# Altium schematic sheet 0115.SchDoc
size 848 x 558 mm
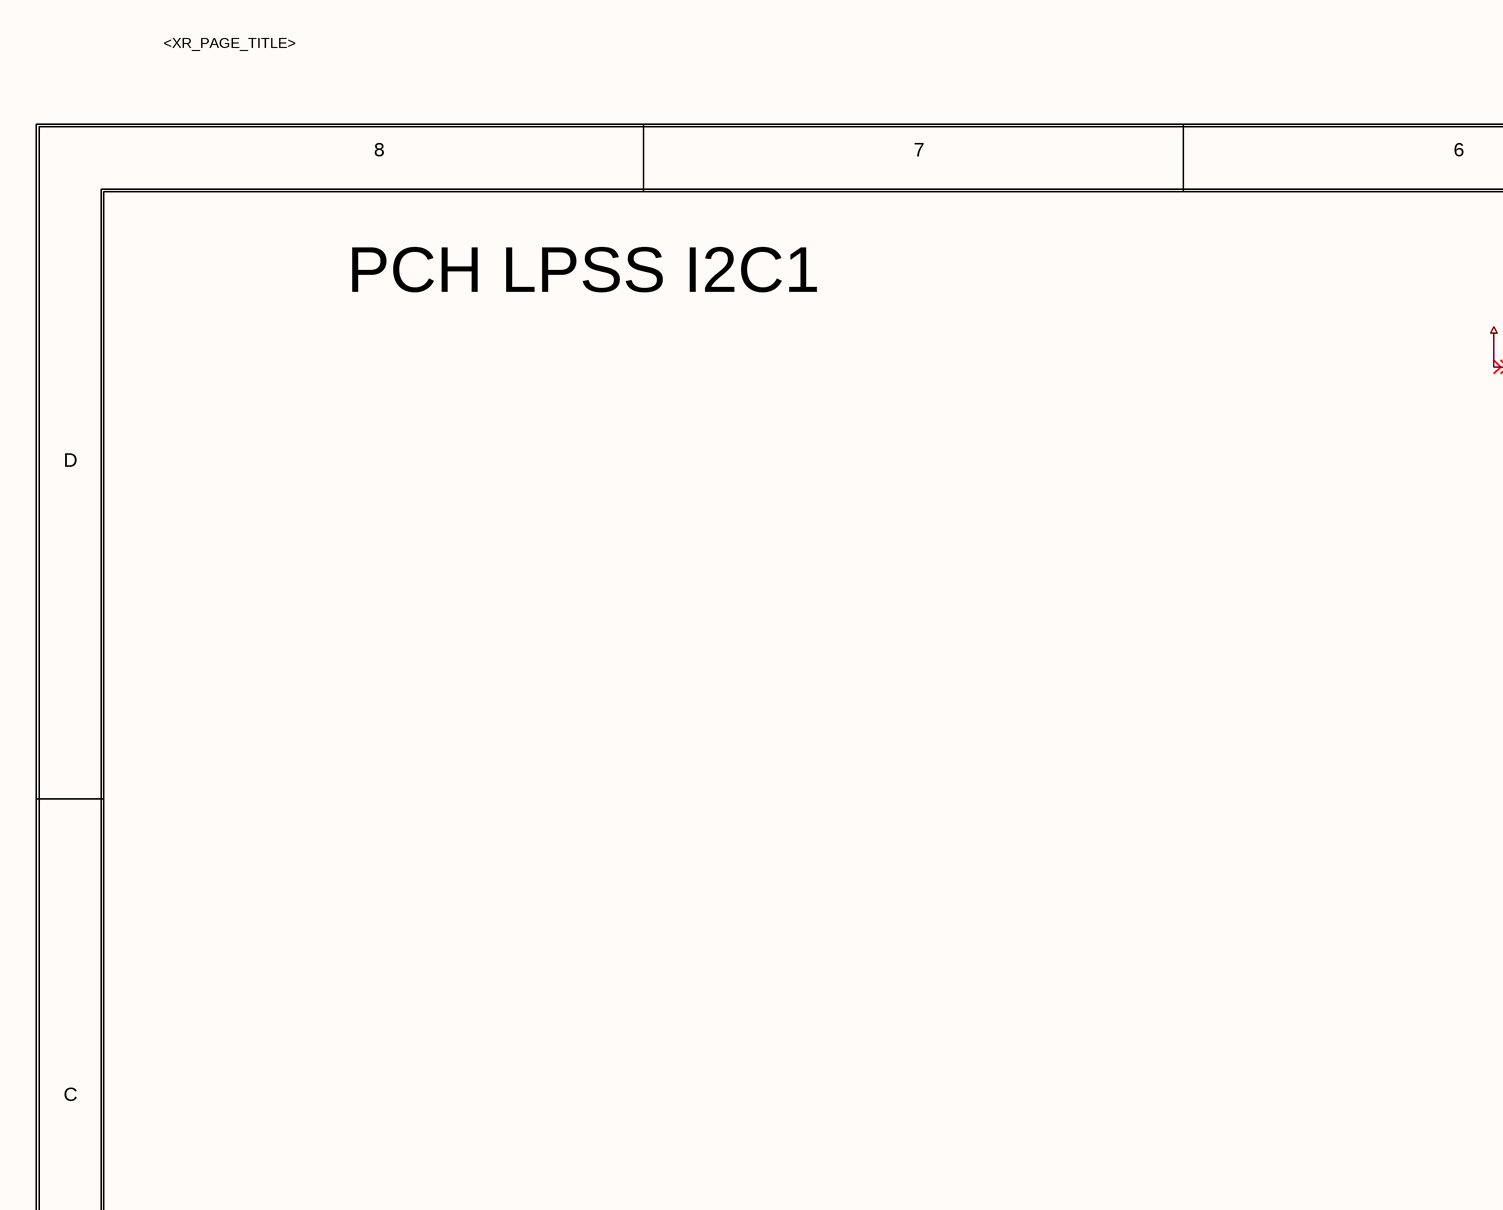
[diagram p0: 0115.SchDoc, top left]
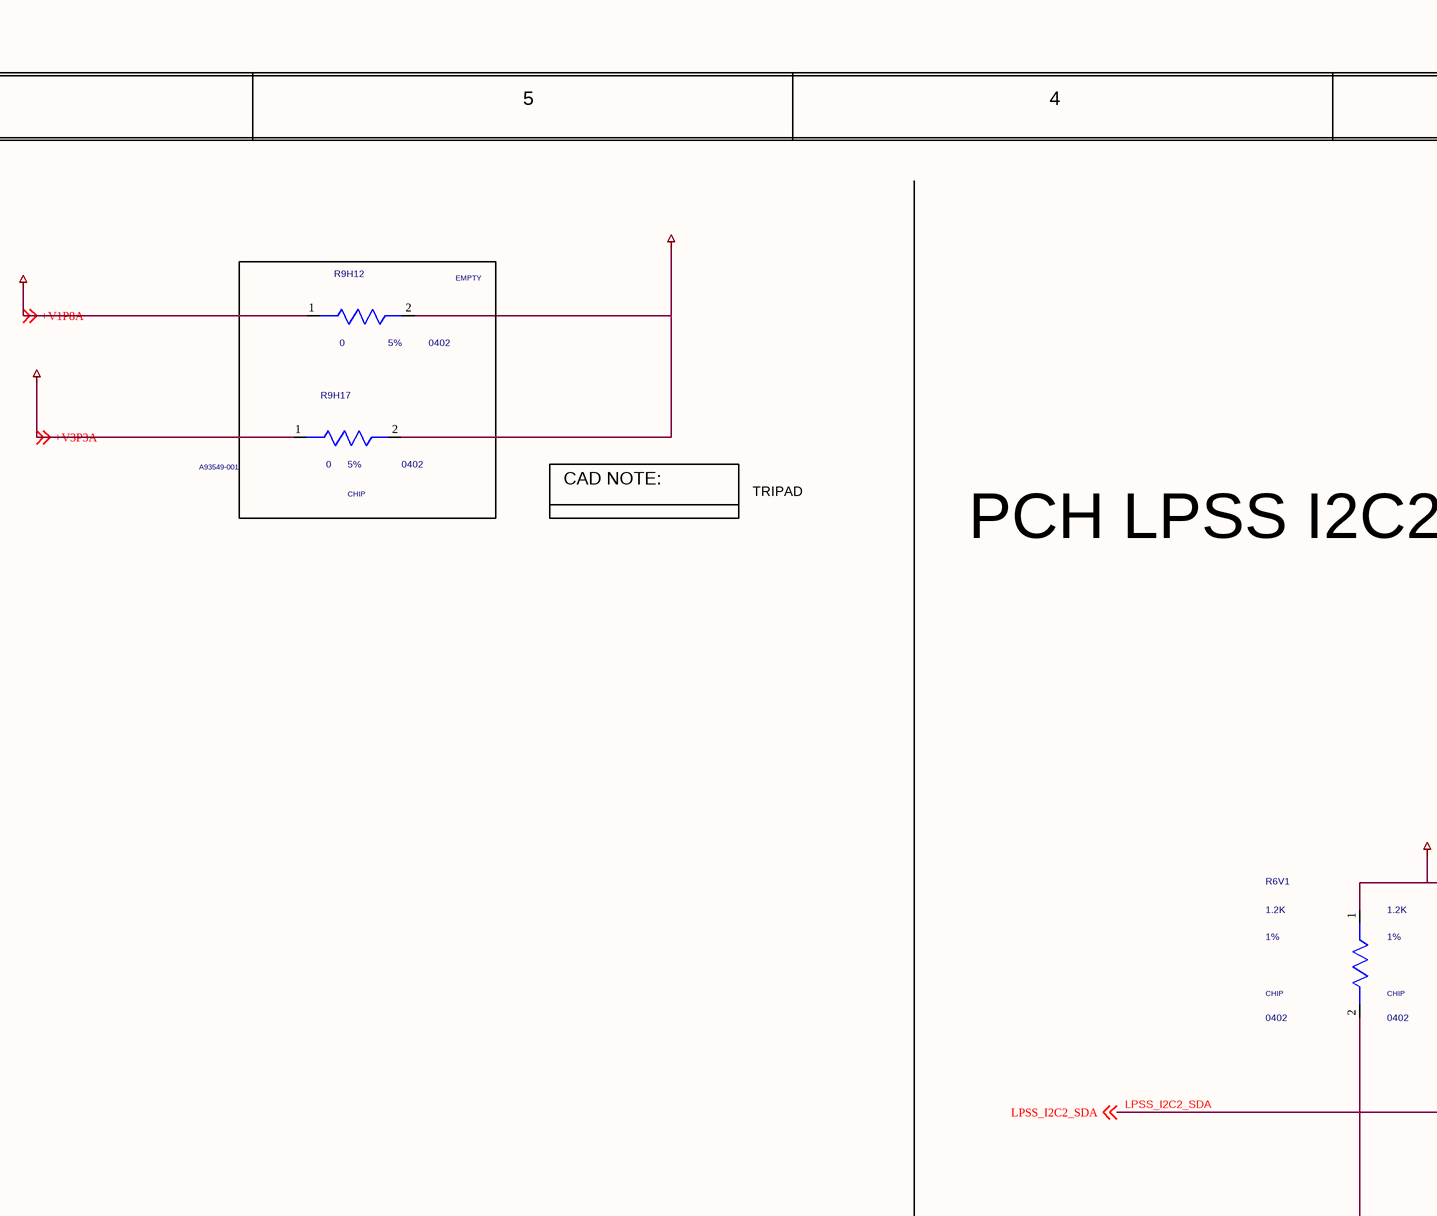
[diagram p1: 0115.SchDoc, top middle]
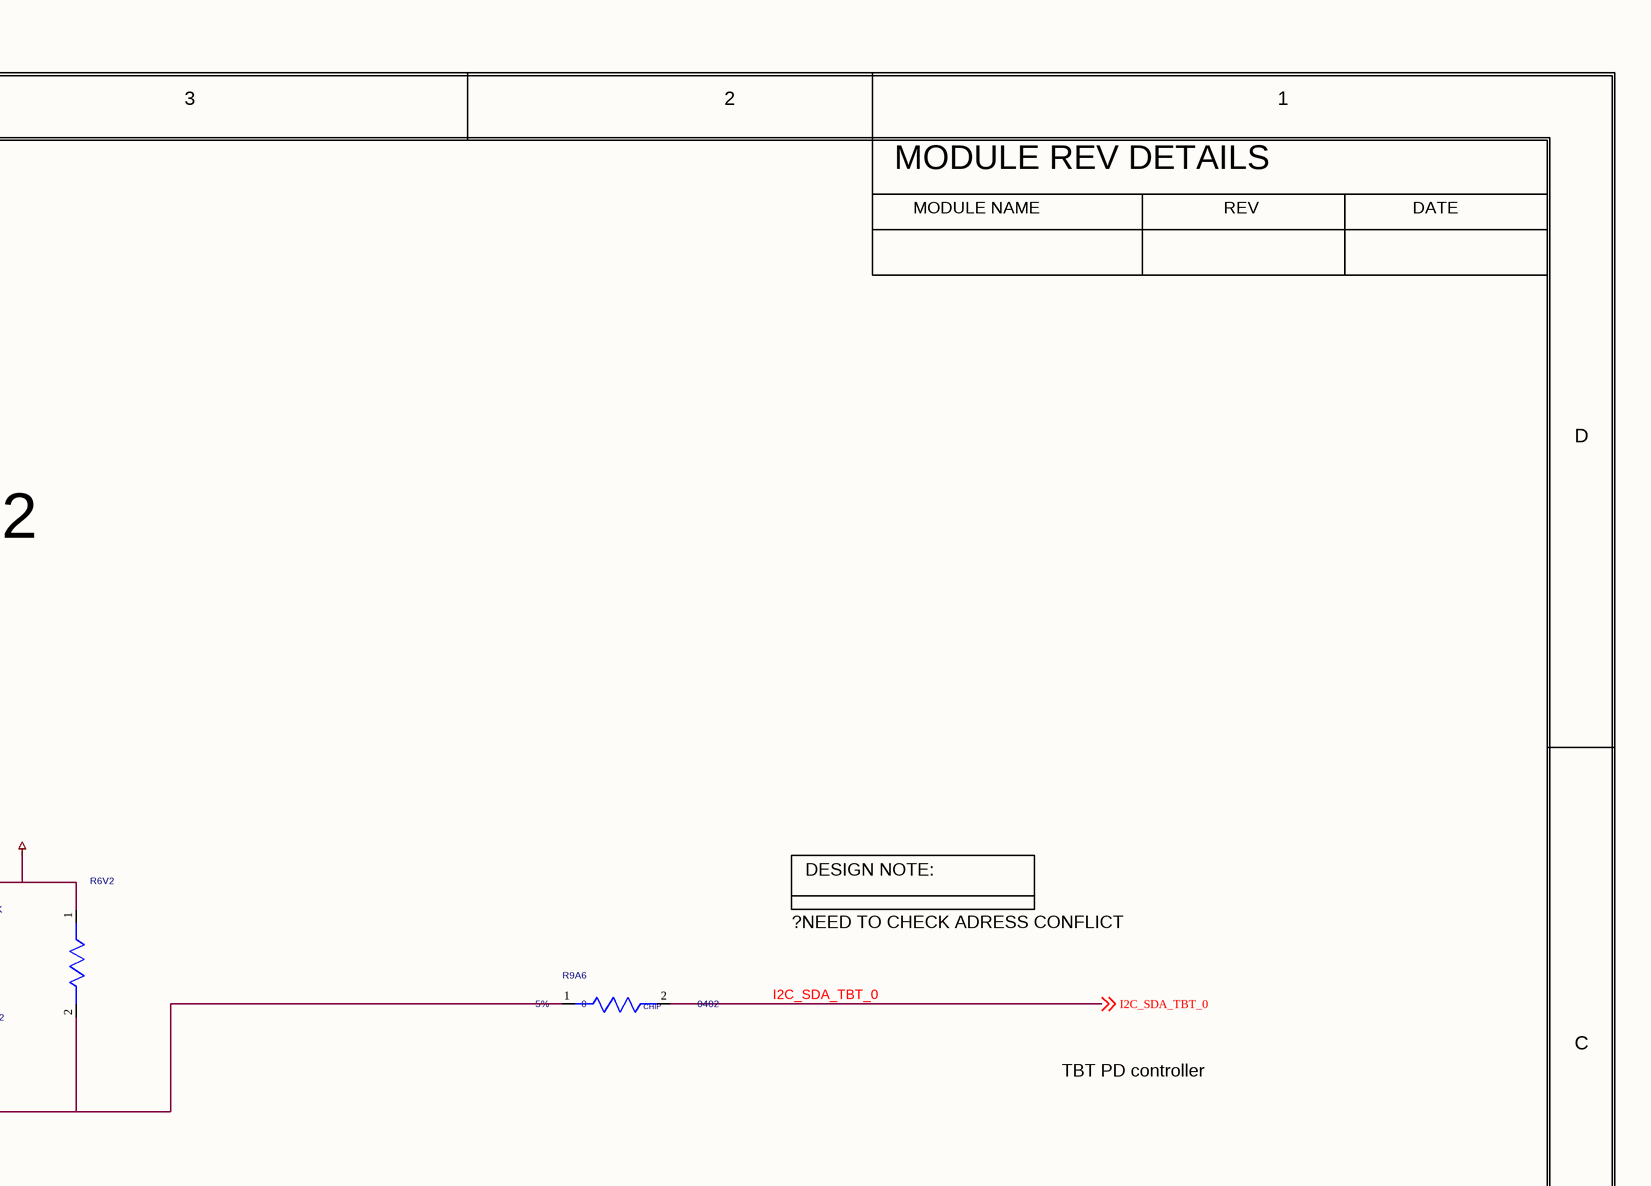
[diagram p2: 0115.SchDoc, top right]
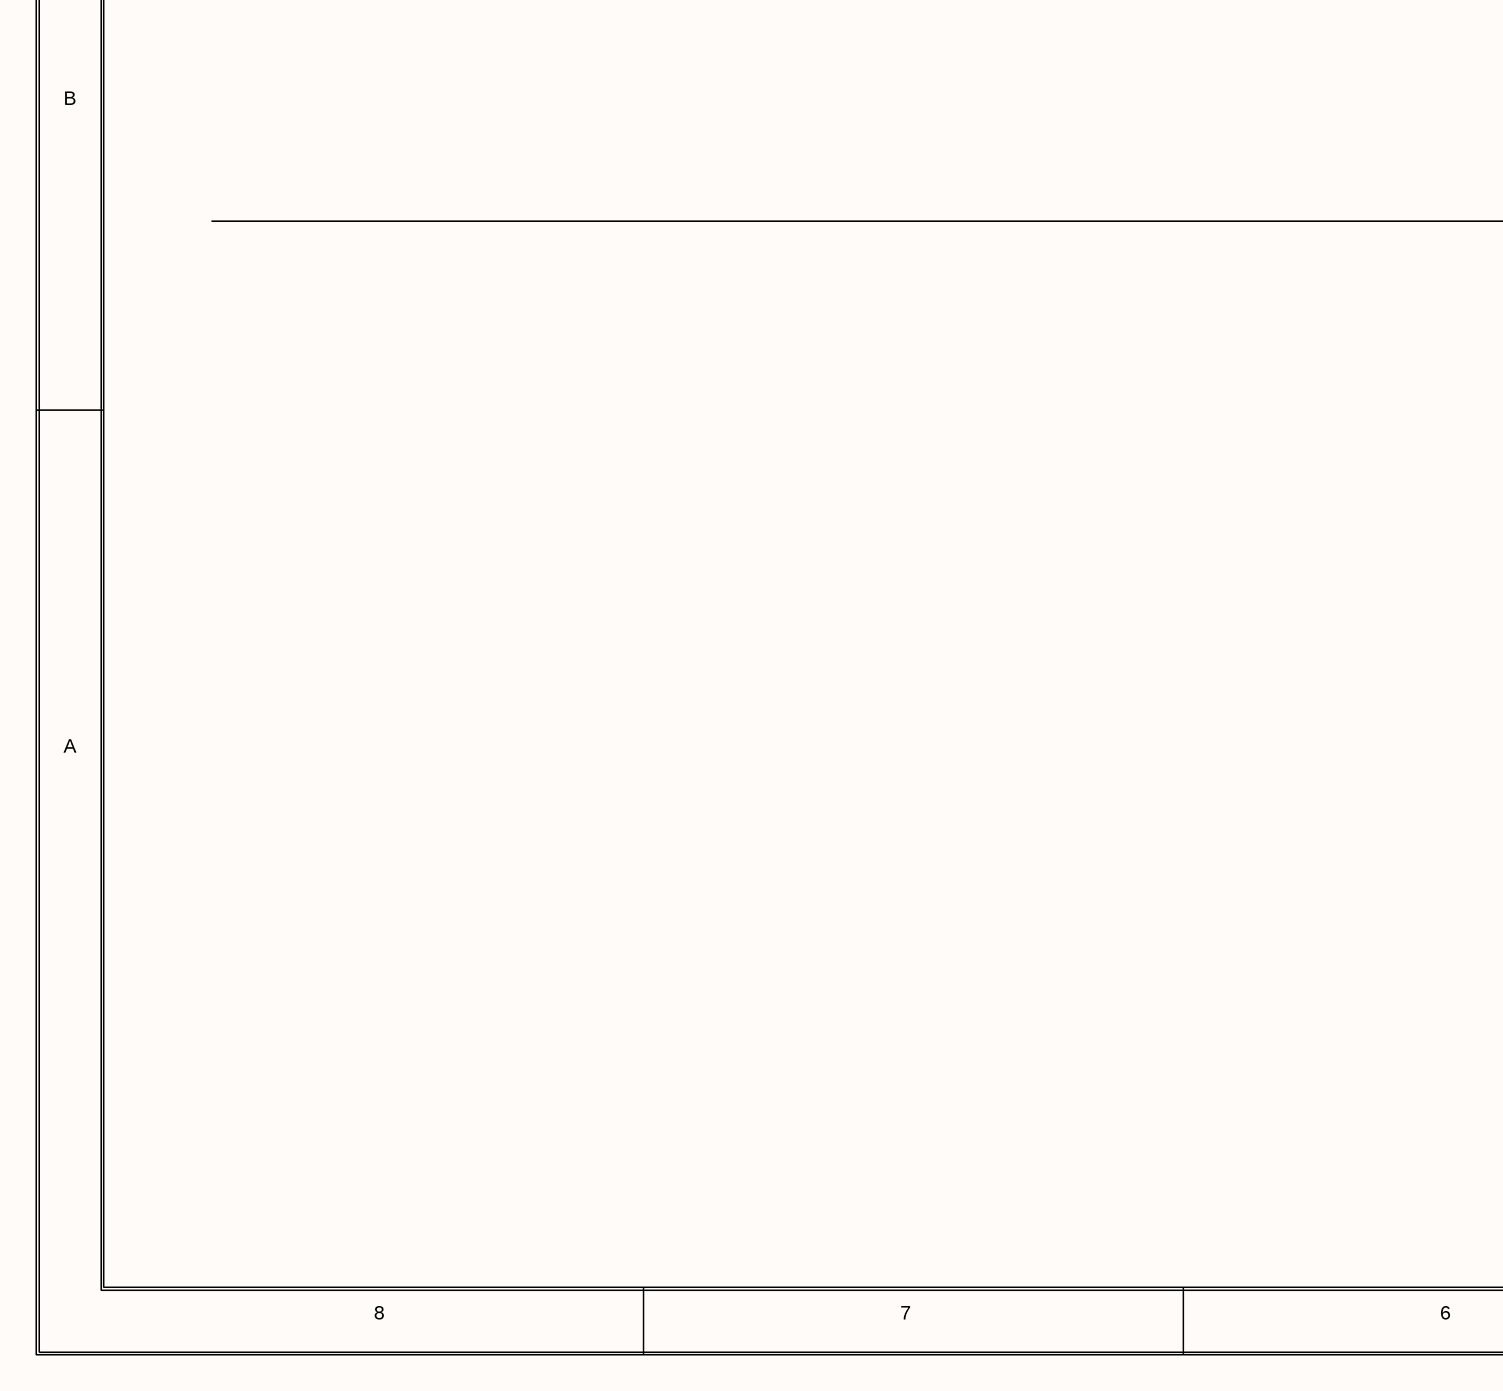
[diagram p3: 0115.SchDoc, bottom left]
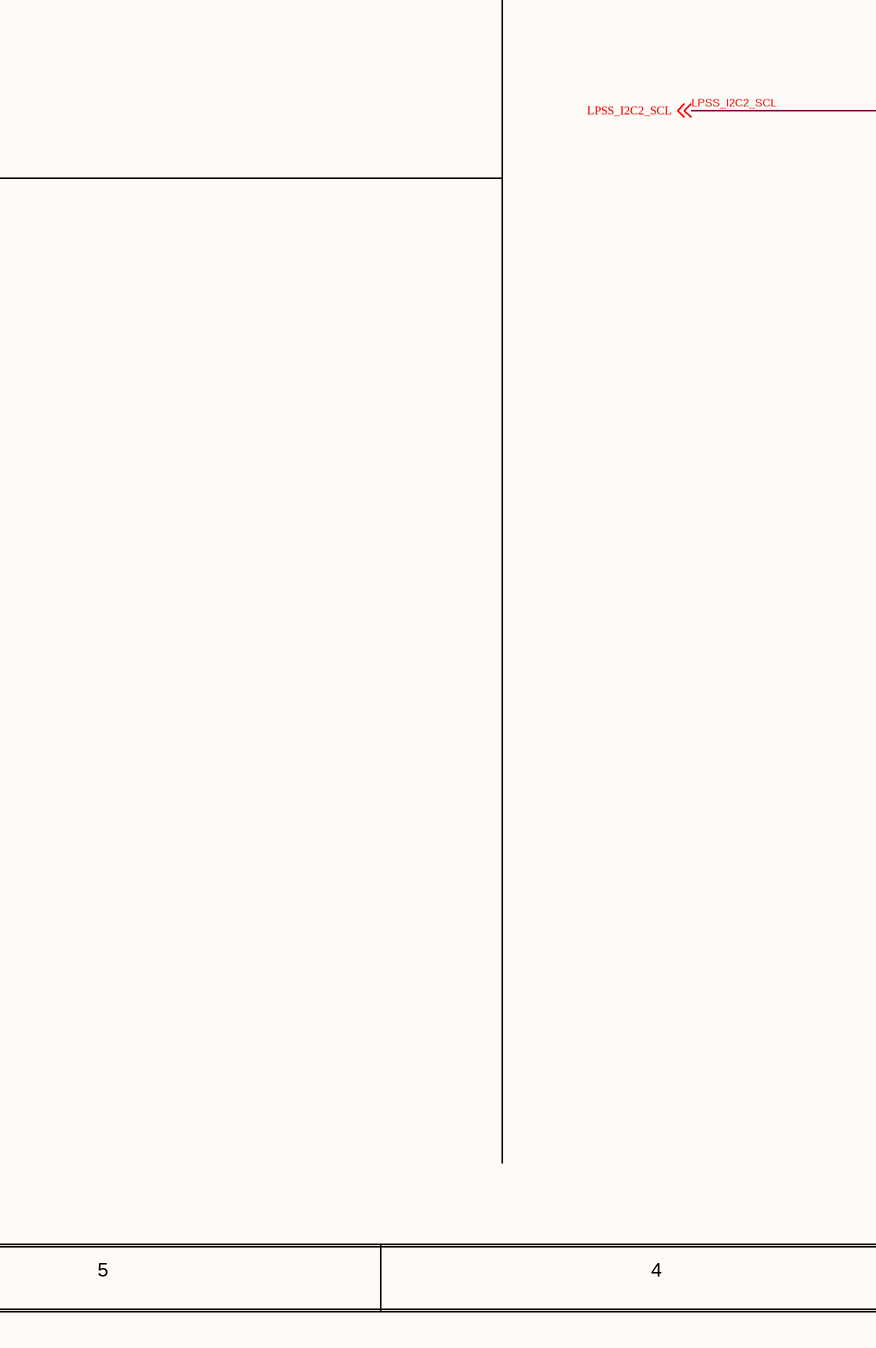
[diagram p4: 0115.SchDoc, bottom middle]
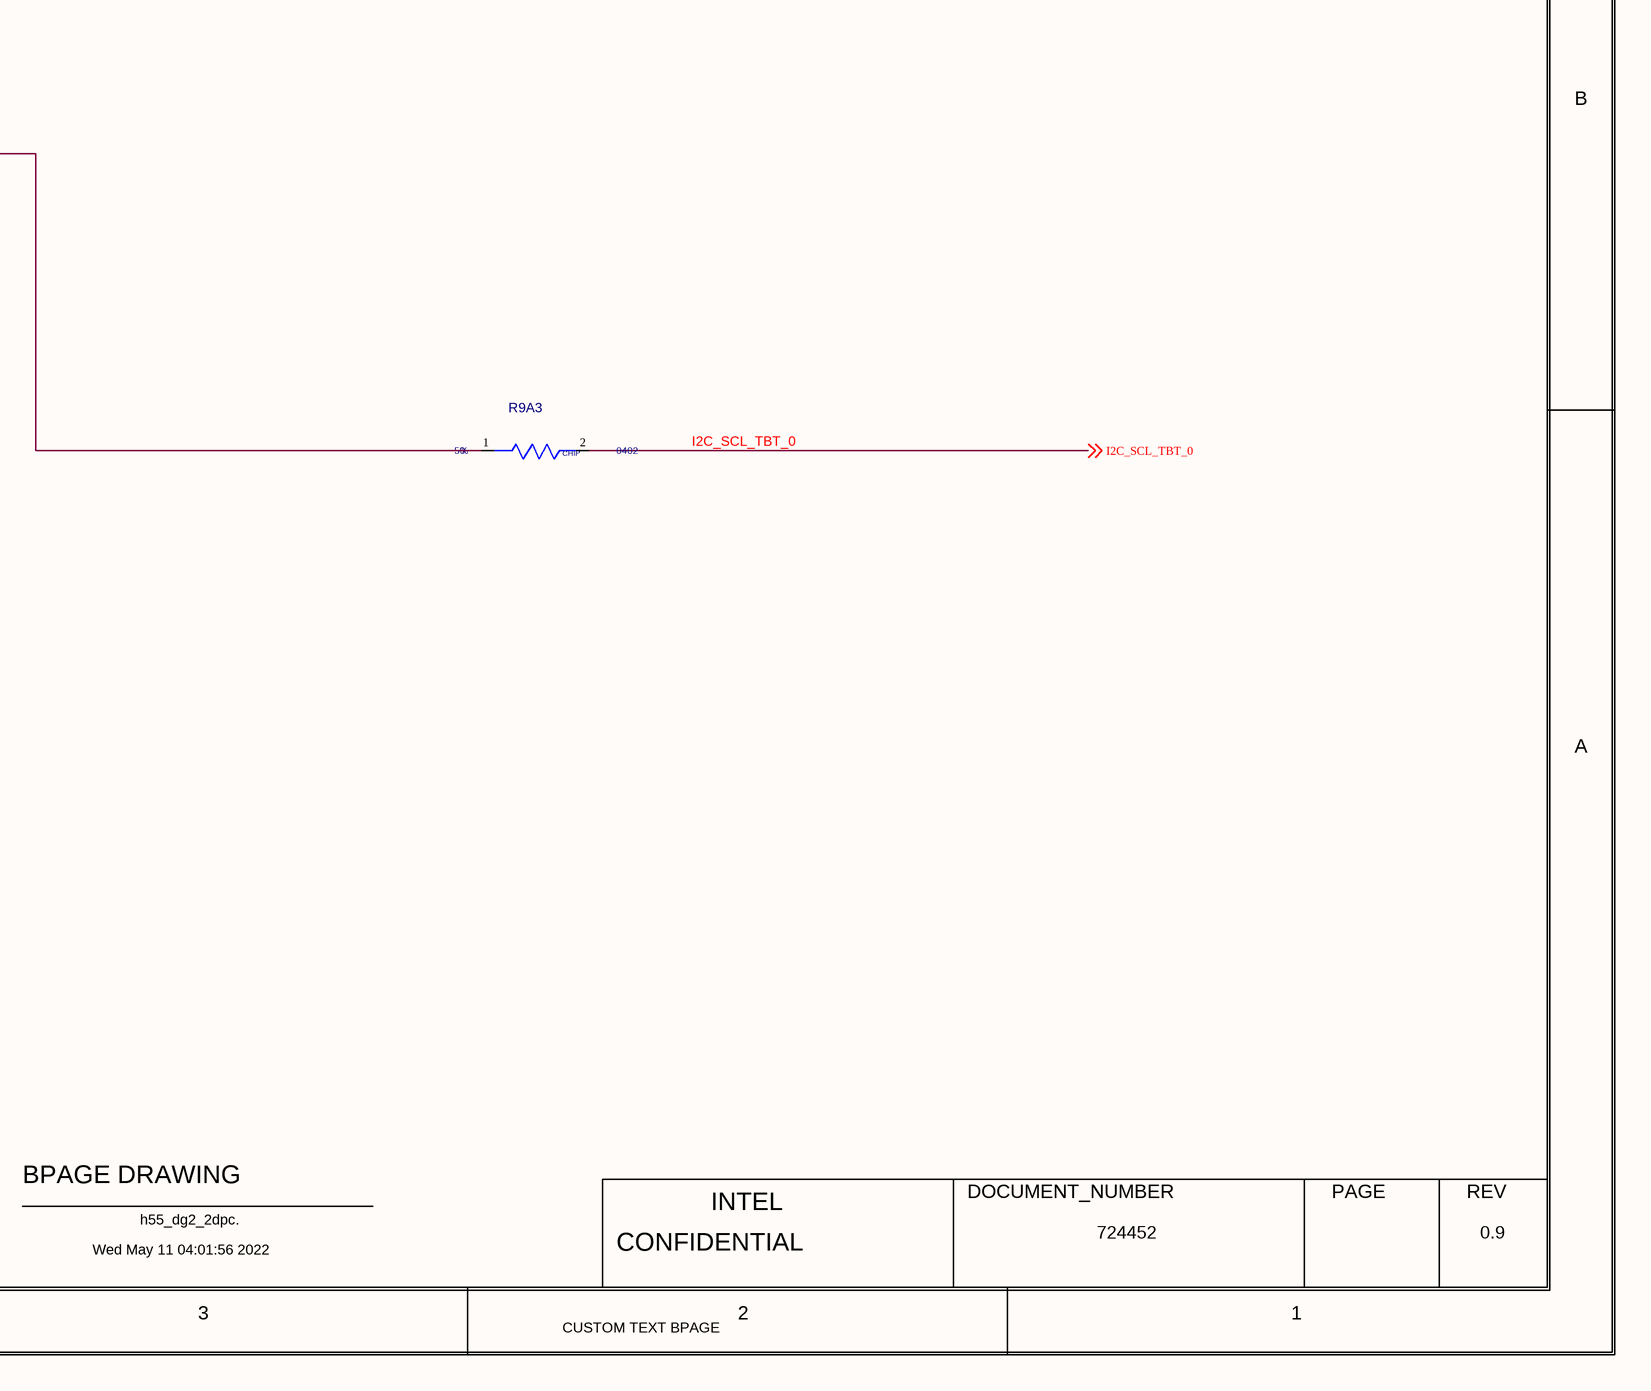
[diagram p5: 0115.SchDoc, bottom right]

## Parts
R6V1  1.2K  MATERIAL: CHIP  PACK_TYPE: 0402  TOLERANCE: 1%  [SMR0402IA]
R6V2  1.2K  MATERIAL: CHIP  PACK_TYPE: 0402  TOLERANCE: 1%  [SMR0402IA]
R9A3  0  MATERIAL: CHIP  PACK_TYPE: 0402  TOLERANCE: 5%  [SMR0402IA]
R9A6  0  MATERIAL: CHIP  PACK_TYPE: 0402  TOLERANCE: 5%  [SMR0402IA]
R9H12  0  MATERIAL: EMPTY  PACK_TYPE: 0402  TOLERANCE: 5%  [SMR0402IA]
R9H17  0  MATERIAL: CHIP  PACK_TYPE: 0402  PART_NUMBER: A93549-001  TOLERANCE: 5%  [SMR0402IA]

## Nets
+V1P8A: R9H12.1(A) ; off-sheet +V1P8A
+V3P3A: R9H17.1(A) ; off-sheet +V3P3A
+V3P3A_V1P8A_I2C: R6V1.1(A) R6V2.1(A) R9H12.2(B) R9H17.2(B)
I2C_SCL_TBT_0: R9A3.2(B) ; off-sheet I2C_SCL_TBT_0
I2C_SDA_TBT_0: R9A6.2(B) ; off-sheet I2C_SDA_TBT_0
LPSS_I2C2_SCL: R6V1.2(B) R9A3.1(A) ; off-sheet LPSS_I2C2_SCL
LPSS_I2C2_SDA: R6V2.2(B) R9A6.1(A) ; off-sheet LPSS_I2C2_SDA

## Notes on the sheet
- <XR_PAGE_TITLE>
- 8
- 7
- 6
- 5
- 4
- 3
- 2
- 1
- MODULE REV DETAILS
- PCH LPSS I2C1
- MODULE NAME
- REV
- DATE
- D
- CAD NOTE:
- TRIPAD
- PCH LPSS I2C2
- DESIGN NOTE:
- ?NEED TO CHECK ADRESS CONFLICT
- C
- TBT PD controller
- B
- A
- BPAGE DRAWING
- INTEL
- DOCUMENT_NUMBER
- PAGE
- Wed May 11 04:01:56 2022
- h55_dg2_2dpc.
- CONFIDENTIAL
- 724452
- 0.9
- CUSTOM TEXT BPAGE

## Library data of the parts
R6V1 = RES: PART_NUMBER: G64084-076; CDS_PHYS_PART_NAME: RES_0402-G64084-076,CHIP,1.2K,1%,1/16W,LPDB,GENERIC; WATTAGE: 1/16W; OriginalSymbolOrigin: (-25,75); XY: (6725,3800); VER: 2; ROT: 0; PHYS_PAGE: 115; LOCATION: R6V1; IP: GENERIC; FP_TECH: LPDB; DRAWING: @RVP1_ADL_SB_ADP_S_DDR5_SODIMM_2DPC_LIB.H55_DG2_2DPC(SCH_1):PAGE386; CDS_LIB: discrete; PCB Footprint: SMR0402IA; CHIPS_PART_NAME: RES; CDS_PART_NAME: RES_0402-G64084-076,CHIP,1.2K,1%,1/16W,LPDB,GENERIC; CDS_LOCATION: R6V1; ASI_MODEL: G64084-076
R6V2 = RES: PART_NUMBER: G64084-076; CDS_PHYS_PART_NAME: RES_0402-G64084-076,CHIP,1.2K,1%,1/16W,LPDB,GENERIC; WATTAGE: 1/16W; OriginalSymbolOrigin: (-25,75); XY: (6950,3800); VER: 2; ROT: 0; PHYS_PAGE: 115; LOCATION: R6V2; IP: GENERIC; FP_TECH: LPDB; DRAWING: @RVP1_ADL_SB_ADP_S_DDR5_SODIMM_2DPC_LIB.H55_DG2_2DPC(SCH_1):PAGE386; CDS_LIB: discrete; PCB Footprint: SMR0402IA; CHIPS_PART_NAME: RES; CDS_PART_NAME: RES_0402-G64084-076,CHIP,1.2K,1%,1/16W,LPDB,GENERIC; CDS_LOCATION: R6V2; ASI_MODEL: G64084-076
R9A3 = RES#1: PART_NUMBER: A93549-001; CHIPS_PART_NAME: RES; CDS_PHYS_PART_NAME: RES_0402-A93549-001,CHIP,0,5%,1/16W,LPDB,GENERIC; WATTAGE: 1/16W; OriginalSymbolOrigin: (-75,25); XY: (7800,1875); VER: 1; PHYS_PAGE: 115; LOCATION: R9A3; IP: GENERIC; FP_TECH: LPDB; DRAWING: @RVP1_ADL_SB_ADP_S_DDR5_SODIMM_2DPC_LIB.H55_DG2_2DPC(SCH_1):PAGE386; CDS_LIB: discrete; PCB Footprint: SMR0402IA; ROT: 0; CDS_PART_NAME: RES_0402-A93549-001,CHIP,0,5%,1/16W,LPDB,GENERIC; CDS_LOCATION: R9A3; ASI_MODEL: A93549-001
R9A6 = RES#1: PART_NUMBER: A93549-001; CHIPS_PART_NAME: RES; CDS_PHYS_PART_NAME: RES_0402-A93549-001,CHIP,0,5%,1/16W,LPDB,GENERIC; WATTAGE: 1/16W; OriginalSymbolOrigin: (-75,25); XY: (7950,3725); VER: 1; PHYS_PAGE: 115; LOCATION: R9A6; IP: GENERIC; FP_TECH: LPDB; DRAWING: @RVP1_ADL_SB_ADP_S_DDR5_SODIMM_2DPC_LIB.H55_DG2_2DPC(SCH_1):PAGE386; CDS_LIB: discrete; PCB Footprint: SMR0402IA; ROT: 0; CDS_PART_NAME: RES_0402-A93549-001,CHIP,0,5%,1/16W,LPDB,GENERIC; CDS_LOCATION: R9A6; ASI_MODEL: A93549-001
R9H12 = RES#1: PART_NUMBER: A93549-001; CHIPS_PART_NAME: RES; CDS_PHYS_PART_NAME: RES_0402-A93549-001,EMPTY,0,5%,1/16W,LPDB,GENERIC; WATTAGE: 1/16W; OriginalSymbolOrigin: (-75,25); XY: (4875,5000); VER: 1; PHYS_PAGE: 115; LOCATION: R9H12; IP: GENERIC; FP_TECH: LPDB; DRAWING: @RVP1_ADL_SB_ADP_S_DDR5_SODIMM_2DPC_LIB.H55_DG2_2DPC(SCH_1):PAGE386; CDS_LIB: discrete; PCB Footprint: SMR0402IA; ROT: 0; CDS_PART_NAME: RES_0402-A93549-001,EMPTY,0,5%,1/16W,LPDB,GENERIC; CDS_LOCATION: R9H12; ASI_MODEL: A93549-001
R9H17 = RES#1: CHIPS_PART_NAME: RES; CDS_PHYS_PART_NAME: RES_0402-A93549-001,CHIP,0,5%,1/16W,LPDB,GENERIC; WATTAGE: 1/16W; OriginalSymbolOrigin: (-75,25); XY: (4850,4775); VER: 1; PHYS_PAGE: 115; LOCATION: R9H17; IP: GENERIC; FP_TECH: LPDB; DRAWING: @RVP1_ADL_SB_ADP_S_DDR5_SODIMM_2DPC_LIB.H55_DG2_2DPC(SCH_1):PAGE386; CDS_LIB: discrete; PCB Footprint: SMR0402IA; ROT: 0; CDS_PART_NAME: RES_0402-A93549-001,CHIP,0,5%,1/16W,LPDB,GENERIC; CDS_LOCATION: R9H17; ASI_MODEL: A93549-001